# Altium schematic sheet Sheet_power_1.SchDoc
size A4
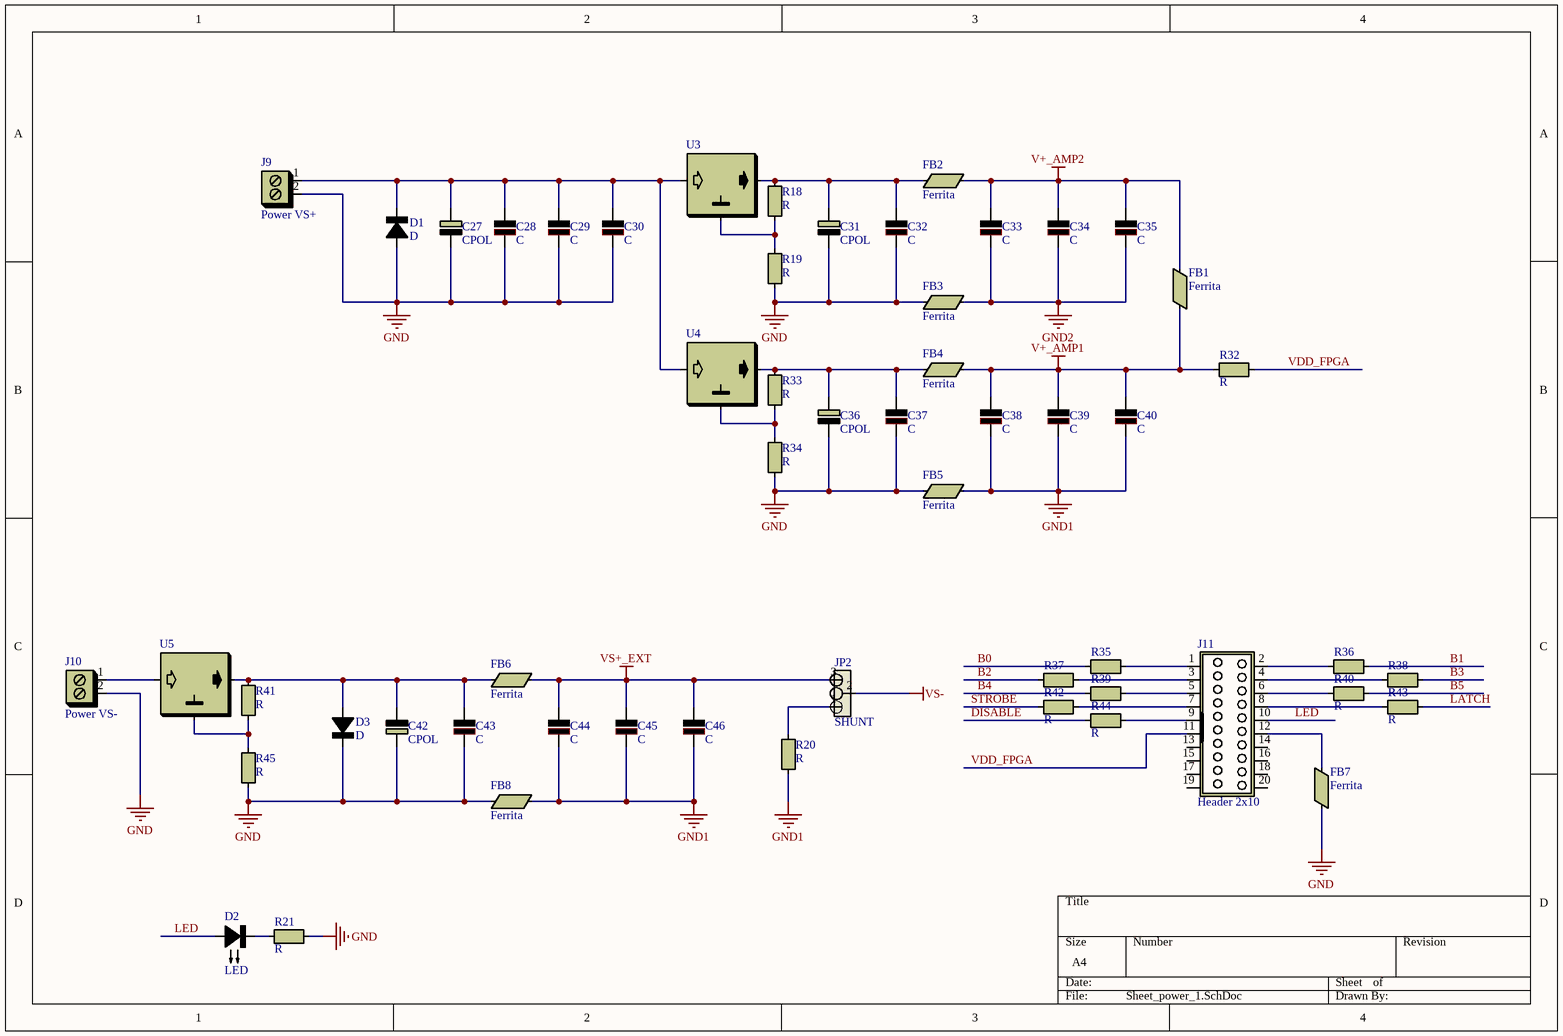
[diagram p0: Sheet_power_1.SchDoc]

## Parts
C27  CPOL  [C_SMD_5.0 x 5.4]
C28  C  [C_0805]
C29  C  [C_0805]
C30  C  [C_0805]
C31  CPOL  [C_SMD_5.0 x 5.4]
C32  C  [C_0805]
C33  C  [C_0805]
C34  C  [C_0805]
C35  C  [C_0805]
C36  CPOL  [C_SMD_5.0 x 5.4]
C37  C  [C_0805]
C38  C  [C_0805]
C39  C  [C_0805]
C40  C  [C_0805]
C42  CPOL  [C_SMD_5.0 x 5.4]
C43  C  [C_0805]
C44  C  [C_0805]
C45  C  [C_0805]
C46  C  [C_0805]
D1  D  [DZENER_0805]
D2  LED  [LED_0805]
D3  D  [DZENER_0805]
FB1  Ferrita  [R_0805]
FB2  Ferrita  [R_0805]
FB3  Ferrita  [R_0805]
FB4  Ferrita  [R_0805]
FB5  Ferrita  [R_0805]
FB6  Ferrita  [R_0805]
FB7  Ferrita  [R_0805]
FB8  Ferrita  [R_0805]
J9  Power VS+  [Borna_PT_2]
J10  Power VS-  [Borna_PT_2]
J11  Header 2x10
JP2  SHUNT  [JUMPER_2,54_3]
R18  R  [R_0603]
R19  R  [R_0603]
R20  R  [R_0603]
R21  R  [R_0603]
R32  R  [R_0603]
R33  R  [R_0603]
R34  R  [R_0603]
R35  R  [R_0603]
R36  R  [R_0603]
R37  R  [R_0603]
R38  R  [R_0603]
R39  R  [R_0603]
R40  R  [R_0603]
R41  R  [R_0603]
R42  R  [R_0603]
R43  R  [R_0603]
R44  R  [R_0603]
R45  R  [R_0603]
U3  VOLTAGE_REGULATOR_3  [REG_DPAK]  (value not drawn)
U4  VOLTAGE_REGULATOR_3  [REG_DPAK]  (value not drawn)
U5  VOLTAGE_REGULATOR_3  [REG_DPAK]  (value not drawn)

## Nets
GND: C27.1 C28.2 C29.2 C30.2 C31.1 C32.2 C36.1 C37.2 C42.2 C43.2 D1.A D3.K FB3.2 FB5.2 FB7.1 FB8.2 J9.2 J10.2 R19.2 R21.2 R34.2 R45.2
GND1: C38.2 C39.2 C40.2 C44.2 C45.2 C46.2 FB5.1 FB8.1 R20.2
GND2: C33.2 C34.2 C35.2 FB3.1
V+_AMP1: C38.1 C39.1 C40.1 FB1.1 FB4.1 R32.1
V+_AMP2: C33.1 C34.1 C35.1 FB1.2 FB2.1
VS+_EXT: C44.1 C45.1 C46.1 FB6.1 JP2.3
VS-: JP2.2
B0: R35.1
B1: R36.2
B2: R37.1
B3: R38.2
B4: R39.1
B5: R40.2
~{DISABLE}: R44.1
LATCH: R43.2
LED: D2.A J11.10
STROBE: R42.1
VDD_FPGA: J11.11 R32.2
NetC27_2: C27.2 C28.1 C29.1 C30.1 D1.K J9.1 U3.IN U4.IN
NetC31_2: C31.2 C32.1 FB2.2 R18.1 U3.OUT
NetC36_2: C36.2 C37.1 FB4.2 R33.1 U4.OUT
NetC42_1: C42.1 C43.1 D3.A FB6.2 R41.1 U5.OUT
NetD2_K: D2.K R21.1
NetFB7_2: FB7.2 J11.12
NetJ10_1: J10.1 U5.IN
NetJ11_1: J11.1 R35.2
NetJ11_2: J11.2 R36.1
NetJ11_3: J11.3 R37.2
NetJ11_4: J11.4 R38.1
NetJ11_5: J11.5 R39.2
NetJ11_6: J11.6 R40.1
NetJ11_7: J11.7 R42.2
NetJ11_8: J11.8 R43.1
NetJ11_9: J11.9 R44.2
NetJP2_1: JP2.1 R20.1
NetR18_2: R18.2 R19.1 U3.GND
NetR33_2: R33.2 R34.1 U4.GND
NetR41_2: R41.2 R45.1 U5.GND

Not connected (* = marked no-connect by the designer): J11 13 14 15 16 17 18 19 20

## Library data of the parts
C27 C31 C36 C42 = CPOL: Precio: 0,553; Código Mouser: 647-UCL1E331MNL1GS
C28-C30 C32-C35 C37-C40 C43-C46 = C: Precio: 0,553; Código Mouser: 647-UCL1E331MNL1GS
D1 D3 = D: Precio: 0,312; Código Mouser: 583-SM4007
D2 = LED: Precio: 0,099; Código Mouser: 859-LTST-S220EKT
J9 J10 = BORNA_2: Precio: 0,95; Código Mouser: 571-1977477-2
R18-R21 R32-R45 = R: Precio: 0,05; Código Mouser: Variable
U3-U5 = VOLTAGE_REGULATOR_3: Precio: 0,71; Código Mouser: 511-L7805CD2T-TR